# EAGLE schematic xmega-flash (EAGLE 6.4)
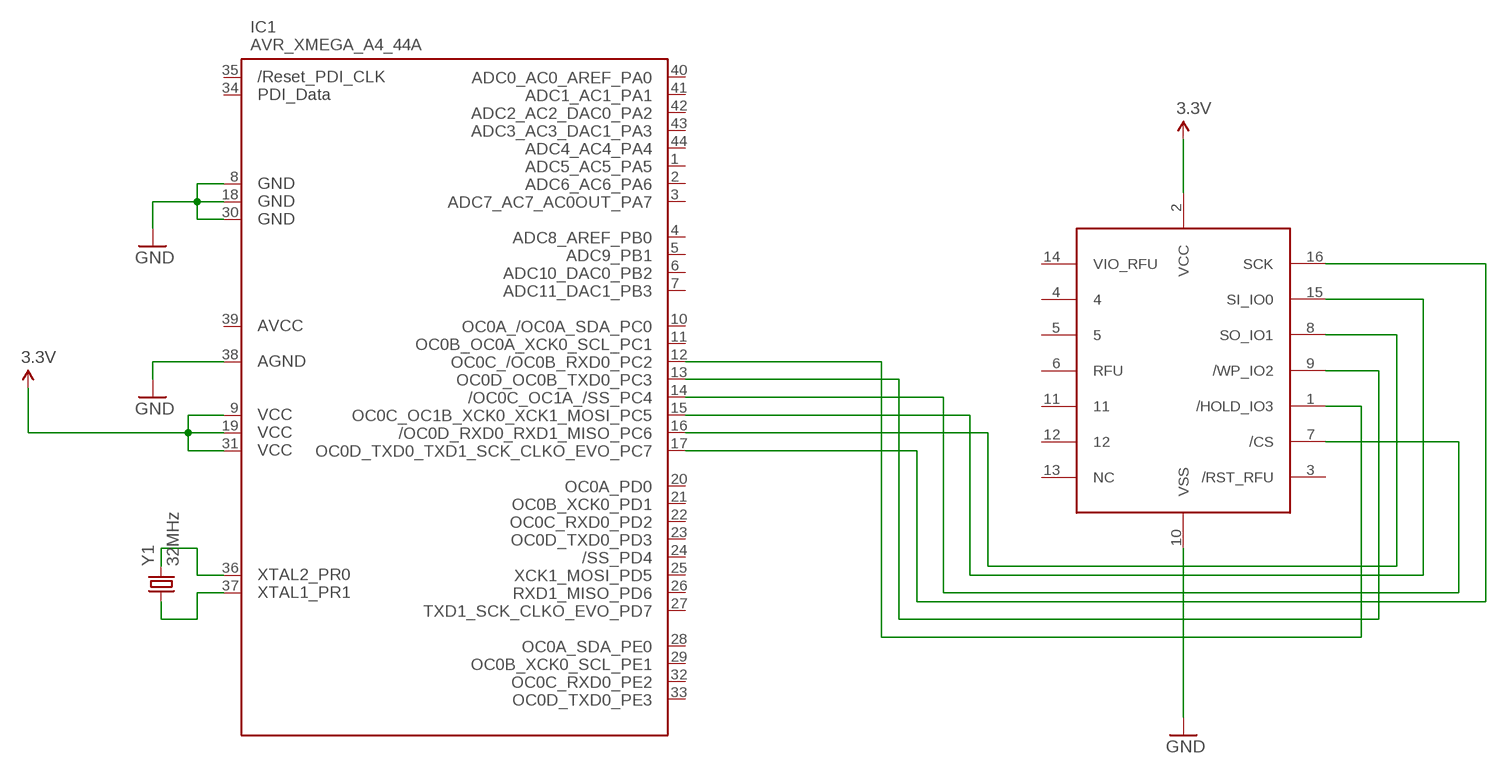
[diagram p0: schematic, sheet 1]

## Parts
IC1  AVR_XMEGA_A4_44A  [TQFP44]
U$1  S25FLS256  [WSOIC-16]
Y1  32MHz  CRYSTAL5X3  [CRYSTAL-SMD-5X3]

## Nets
3.3V: IC1.9(VCC1) IC1.19(VCC2) IC1.31(VCC3) U$1.2(VCC)
GND: IC1.8(GND1) IC1.18(GND2) IC1.30(GND3) IC1.38(AGND) U$1.10(VSS)
N$1: IC1.17(PC7) U$1.16(SCK)
N$2: IC1.14(PC4) U$1.7(/CS)
N$3: IC1.15(PC5) U$1.15(SI_IO0)
N$4: IC1.16(PC6) U$1.8(SO_IO1)
N$5: IC1.13(PC3) U$1.9(/WP_IO2)
N$6: IC1.12(PC2) U$1.1(/HOLD_IO3)
N$7: IC1.36(PR0) Y1.3
N$8: IC1.37(PR1) Y1.1
Unconnected: IC1.1(PA5) IC1.2(PA6) IC1.3(PA7) IC1.4(PB0) IC1.5(PB1) IC1.6(PB2) IC1.7(PB3) IC1.10(PC0) IC1.11(PC1) IC1.20(PD0) IC1.21(PD1) IC1.22(PD2) IC1.23(PD3) IC1.24(PD4) IC1.25(PD5) IC1.26(PD6) IC1.27(PD7) IC1.28(PE0) IC1.29(PE1) IC1.32(PE2) IC1.33(PE3) IC1.34(PDI_DATA) IC1.35(RESET) IC1.39(AVCC) IC1.40(PA0) IC1.41(PA1) IC1.42(PA2) IC1.43(PA3) IC1.44(PA4) U$1.3(/RST_RFU) U$1.4 U$1.5 U$1.6(RFU) U$1.11 U$1.12 U$1.13(NC) U$1.14(VIO_RFU)

## Library data of the parts
IC1 = xmega:AVR_XMEGA_A4_: Device for Atmel AVR XMEGA A4 Series
U$1 = Synapseware:S25FLS256
Y1 = SparkFun-FreqCtrl:CRYSTAL: Various standard crystals. Proven footprints. Spark Fun Electronics SKU : COM-00534